# EAGLE design KGGR_D (EAGLE 9.4.2)
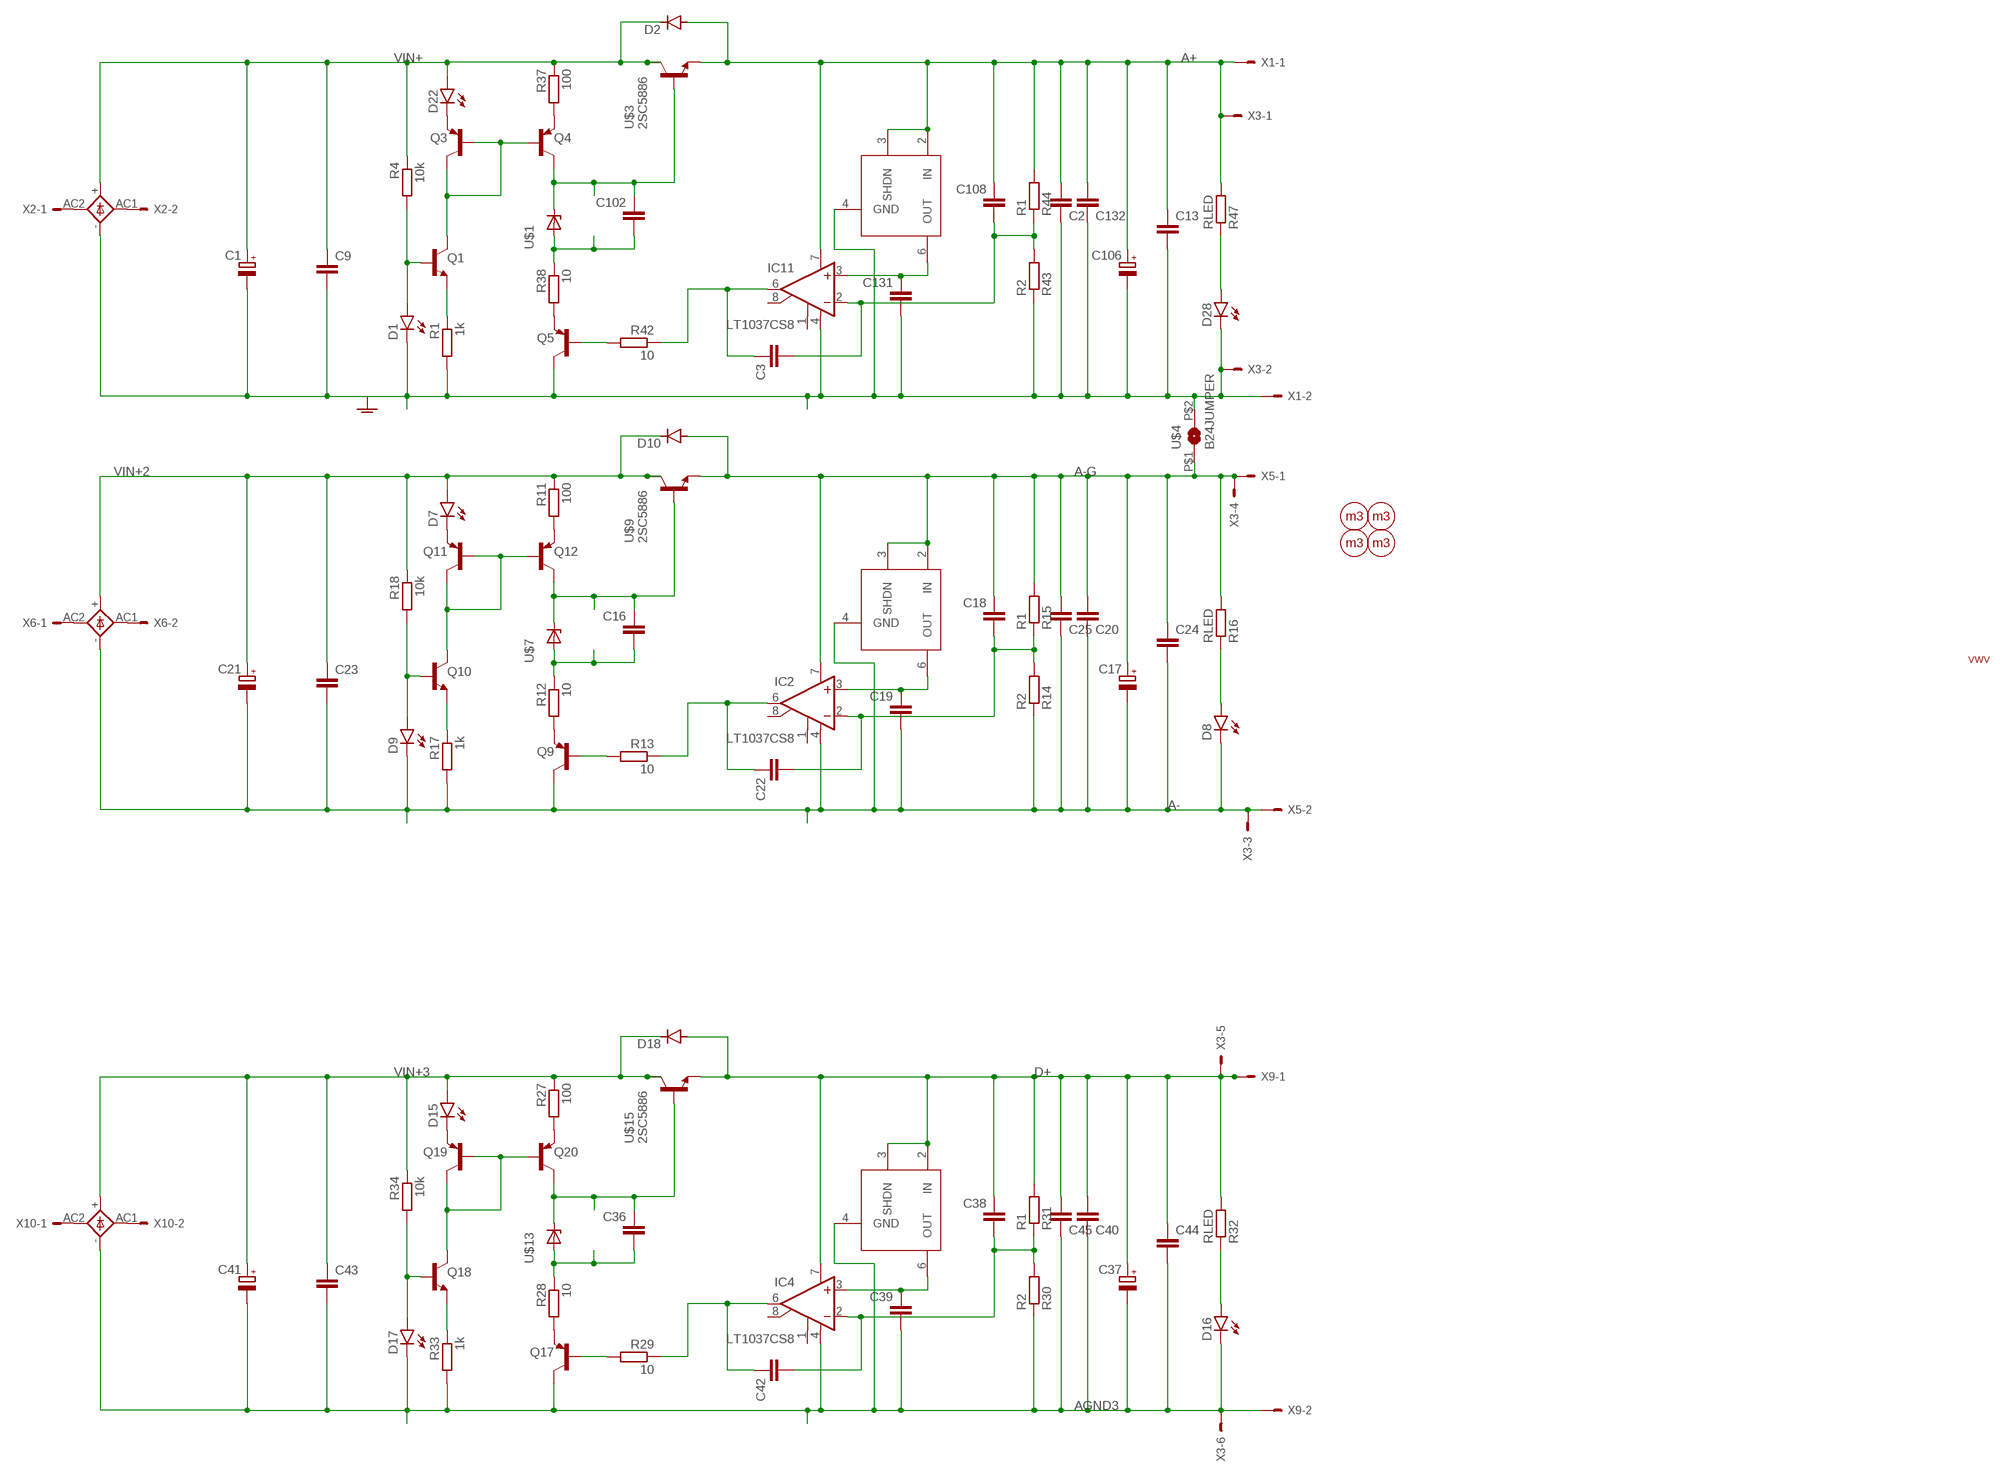
[diagram p0: schematic, sheet 1]

## Parts
B1  GBU4  [GBU4S]
B3  GBU4  [GBU4S]
B5  GBU4  [GBU4S]
C1  CPOL-EUE7.5-18  [E7,5-18]
C2  C-EUC0805  [C0805]
C3  C-EUC0805  [C0805]
C9  C-EU050-050X075  [C050-050X075]
C13  C-EU050-050X075  [C050-050X075]
C16  C-EUC0805  [C0805]
C17  CPOL-EUE5-10.5  [E5-10,5]
C18  C-EUC0805  [C0805]
C19  C-EUC1206  [C1206]
C20  C-EUC0805  [C0805]
C21  CPOL-EUE7.5-18  [E7,5-18]
C22  C-EUC0805  [C0805]
C23  C-EU050-050X075  [C050-050X075]
C24  C-EU050-050X075  [C050-050X075]
C25  C-EUC0805  [C0805]
C36  C-EUC0805  [C0805]
C37  CPOL-EUE5-10.5  [E5-10,5]
C38  C-EUC0805  [C0805]
C39  C-EUC1206  [C1206]
C40  C-EUC0805  [C0805]
C41  CPOL-EUE7.5-18  [E7,5-18]
C42  C-EUC0805  [C0805]
C43  C-EU050-050X075  [C050-050X075]
C44  C-EU050-050X075  [C050-050X075]
C45  C-EUC0805  [C0805]
C102  C-EUC0805  [C0805]
C106  CPOL-EUE5-10.5  [E5-10,5]
C108  C-EUC0805  [C0805]
C131  C-EUC1206  [C1206]
C132  C-EUC0805  [C0805]
D1  LEDVWV1206  [LED_SML1206]
D2  DIODE-DO214AC  [DO214AC]
D7  LEDVWV1206  [LED_SML1206]
D8  LEDVWV1206  [LED_SML1206]
D9  LEDVWV1206  [LED_SML1206]
D10  DIODE-DO214AC  [DO214AC]
D15  LEDVWV1206  [LED_SML1206]
D16  LEDVWV1206  [LED_SML1206]
D17  LEDVWV1206  [LED_SML1206]
D18  DIODE-DO214AC  [DO214AC]
D22  LEDVWV1206  [LED_SML1206]
D28  LEDVWV1206  [LED_SML1206]
H1  HOLE  [M3_HOLE]
H2  HOLE  [M3_HOLE]
H3  HOLE  [M3_HOLE]
H4  HOLE  [M3_HOLE]
IC2  LT1037CS8  [SOIC8]
IC4  LT1037CS8  [SOIC8]
IC11  LT1037CS8  [SOIC8]
Q1  TRANSISTOR_BC847CLT1-NPN-SOT23-BEC  [TRANSISTOR_SOT23-BEC]
Q3  TRANSISTOR_BC857C-PNP-SOT23-BEC  [TRANSISTOR_SOT23-BEC]
Q4  TRANSISTOR_BC857C-PNP-SOT23-BEC  [TRANSISTOR_SOT23-BEC]
Q5  TRANSISTOR_BC857C-PNP-SOT23-BEC  [TRANSISTOR_SOT23-BEC]
Q9  TRANSISTOR_BC857C-PNP-SOT23-BEC  [TRANSISTOR_SOT23-BEC]
Q10  TRANSISTOR_BC847CLT1-NPN-SOT23-BEC  [TRANSISTOR_SOT23-BEC]
Q11  TRANSISTOR_BC857C-PNP-SOT23-BEC  [TRANSISTOR_SOT23-BEC]
Q12  TRANSISTOR_BC857C-PNP-SOT23-BEC  [TRANSISTOR_SOT23-BEC]
Q17  TRANSISTOR_BC857C-PNP-SOT23-BEC  [TRANSISTOR_SOT23-BEC]
Q18  TRANSISTOR_BC847CLT1-NPN-SOT23-BEC  [TRANSISTOR_SOT23-BEC]
Q19  TRANSISTOR_BC857C-PNP-SOT23-BEC  [TRANSISTOR_SOT23-BEC]
Q20  TRANSISTOR_BC857C-PNP-SOT23-BEC  [TRANSISTOR_SOT23-BEC]
R1  1k  R-EU_MELF0204W  [MINI_MELF-0204W]
R4  10k  R-EU_MELF0204W  [MINI_MELF-0204W]
R11  100  R-EU_MELF0204W  [MINI_MELF-0204W]
R12  10  R-EU_MELF0204W  [MINI_MELF-0204W]
R13  10  R-EU_MELF0204W  [MINI_MELF-0204W]
R14  R2  R-EU_MELF0204W  [MINI_MELF-0204W]
R15  R1  R-EU_MELF0204W  [MINI_MELF-0204W]
R16  RLED  R-EU_MELF0204W  [MINI_MELF-0204W]
R17  1k  R-EU_MELF0204W  [MINI_MELF-0204W]
R18  10k  R-EU_MELF0204W  [MINI_MELF-0204W]
R27  100  R-EU_MELF0204W  [MINI_MELF-0204W]
R28  10  R-EU_MELF0204W  [MINI_MELF-0204W]
R29  10  R-EU_MELF0204W  [MINI_MELF-0204W]
R30  R2  R-EU_MELF0204W  [MINI_MELF-0204W]
R31  R1  R-EU_MELF0204W  [MINI_MELF-0204W]
R32  RLED  R-EU_MELF0204W  [MINI_MELF-0204W]
R33  1k  R-EU_MELF0204W  [MINI_MELF-0204W]
R34  10k  R-EU_MELF0204W  [MINI_MELF-0204W]
R37  100  R-EU_MELF0204W  [MINI_MELF-0204W]
R38  10  R-EU_MELF0204W  [MINI_MELF-0204W]
R42  10  R-EU_MELF0204W  [MINI_MELF-0204W]
R43  R2  R-EU_MELF0204W  [MINI_MELF-0204W]
R44  R1  R-EU_MELF0204W  [MINI_MELF-0204W]
R47  RLED  R-EU_MELF0204W  [MINI_MELF-0204W]
S1  VWV  [VWV]
U$1  ADR504X  [SOT-23]
U$2  LT6657  [MSOP8]
U$3  2SC5886  [NEW-PWMOLD]
U$4  B24JUMPER  [B24J]
U$7  ADR504X  [SOT-23]
U$8  LT6657  [MSOP8]
U$9  2SC5886  [NEW-PWMOLD]
U$13  ADR504X  [SOT-23]
U$14  LT6657  [MSOP8]
U$15  2SC5886  [NEW-PWMOLD]
X1  KK-156-2  [KK-156-2]
X2  KK-156-2  [KK-156-2]
X3  KK-156-6  [KK-156-6]
X5  KK-156-2  [KK-156-2]
X6  KK-156-2  [KK-156-2]
X9  KK-156-2  [KK-156-2]
X10  KK-156-2  [KK-156-2]

## Nets
A+: C2.2 C13.1 C106.+ C108.1 C132.2 D2.A IC11.7(V+) R44.2 R47.2 U$2.2(IN) U$2.3(SHDN) U$3.3(E) X1.1 X3.1
A-: B3.- C17.- C19.2 C20.1 C21.- C23.2 C24.2 C25.1 D8.C D9.C IC2.4(V-) Q9.C R14.1 R17.2 U$8.4(GND) X3.3 X5.2
A-G: C17.+ C18.1 C20.2 C24.1 C25.2 D10.A IC2.7(V+) R15.2 R16.2 U$4.P$1 U$8.2(IN) U$8.3(SHDN) U$9.3(E) X3.4 X5.1
AGND: B1.- C1.- C2.1 C9.2 C13.2 C106.- C131.2 C132.1 D1.C D28.C IC11.4(V-) Q5.C R1.2 R43.1 U$2.4(GND) U$4.P$2 X1.2 X3.2
AGND3: B5.- C37.- C39.2 C40.1 C41.- C43.2 C44.2 C45.1 D16.C D17.C IC4.4(V-) Q17.C R30.1 R33.2 U$14.4(GND) X3.6 X9.2
D+: C37.+ C38.1 C40.2 C44.1 C45.2 D18.A IC4.7(V+) R31.2 R32.2 U$14.2(IN) U$14.3(SHDN) U$15.3(E) X3.5 X9.1
N$1: C102.1 Q4.C U$1.1(OUT) U$3.1(B)
N$2: D22.C Q3.E
N$3: Q4.E R37.2
N$4: B1.AC1(AC2) X2.2
N$5: B1.AC2(AC1) X2.1
N$9: Q1.E R1.1
N$10: D1.A Q1.B R4.2
N$25: Q10.C Q11.B Q11.C Q12.B
N$26: C16.2 R12.1 U$7.2(GND)
N$27: Q9.E R12.2
N$28: Q9.B R13.2
N$29: C18.2 C22.2 IC2.2(-IN) R14.2 R15.1
N$30: D8.A R16.1
N$31: C19.1 IC2.3(+IN) U$8.6(OUT)
N$32: C22.1 IC2.6(OUT) R13.1
N$33: Q10.E R17.1
N$34: D9.A Q10.B R18.2
N$35: C16.1 Q12.C U$7.1(OUT) U$9.1(B)
N$36: D7.C Q11.E
N$37: Q12.E R11.2
N$38: B3.AC1(AC2) X6.2
N$39: B3.AC2(AC1) X6.1
N$59: Q18.C Q19.B Q19.C Q20.B
N$60: C36.2 R28.1 U$13.2(GND)
N$61: Q17.E R28.2
N$62: Q17.B R29.2
N$63: C38.2 C42.2 IC4.2(-IN) R30.2 R31.1
N$64: D16.A R32.1
N$65: C39.1 IC4.3(+IN) U$14.6(OUT)
N$66: C42.1 IC4.6(OUT) R29.1
N$68: Q18.E R33.1
N$69: D17.A Q18.B R34.2
N$71: C36.1 Q20.C U$13.1(OUT) U$15.1(B)
N$72: D15.C Q19.E
N$73: Q20.E R27.2
N$74: B5.AC1(AC2) X10.2
N$75: B5.AC2(AC1) X10.1
N$96: Q1.C Q3.B Q3.C Q4.B
N$98: C102.2 R38.1 U$1.2(GND)
N$99: Q5.E R38.2
N$105: Q5.B R42.2
N$106: C3.2 C108.2 IC11.2(-IN) R43.2 R44.1
N$108: D28.A R47.1
N$111: C131.1 IC11.3(+IN) U$2.6(OUT)
N$112: C3.1 IC11.6(OUT) R42.1
VIN+: B1.+ C1.+ C9.1 D2.C D22.A R4.1 R37.1 U$3.2(C) U$3.4(C) U$3.P$1(C) U$3.P$2(C) U$3.P$3(C) U$3.P$4(C) U$3.P$5(C) U$3.P$6(C) U$3.P$7(C) U$3.P$8(C) U$3.P$9(C) U$3.P$10(C) U$3.P$11(C) U$3.P$12(C) U$3.P$13(C) U$3.P$14(C) U$3.P$15(C) U$3.P$16(C) U$3.P$17(C) U$3.P$18(C) U$3.P$19(C) U$3.P$20(C) U$3.P$21(C) U$3.P$22(C) U$3.P$23(C) U$3.P$24(C) U$3.P$25(C) U$3.P$26(C) U$3.P$27(C) U$3.P$28(C) U$3.P$29(C) U$3.P$30(C) U$3.P$31(C) U$3.P$32(C) U$3.P$33(C) U$3.P$34(C) U$3.P$35(C) U$3.P$36(C) U$3.P$37(C) U$3.P$38(C) U$3.P$39(C) U$3.P$40(C) U$3.P$41(C) U$3.P$42(C) U$3.P$43(C) U$3.P$44(C) U$3.P$45(C) U$3.P$46(C) U$3.P$47(C) U$3.P$48(C) U$3.P$49(C) U$3.P$50(C) U$3.P$51(C) U$3.P$52(C) U$3.P$53(C) U$3.P$54(C) U$3.P$55(C) U$3.P$56(C) U$3.P$57(C) U$3.P$58(C) U$3.P$59(C) U$3.P$60(C) U$3.P$61(C) U$3.P$62(C) U$3.P$63(C)
VIN+2: B3.+ C21.+ C23.1 D7.A D10.C R11.1 R18.1 U$9.2(C) U$9.4(C) U$9.P$1(C) U$9.P$2(C) U$9.P$3(C) U$9.P$4(C) U$9.P$5(C) U$9.P$6(C) U$9.P$7(C) U$9.P$8(C) U$9.P$9(C) U$9.P$10(C) U$9.P$11(C) U$9.P$12(C) U$9.P$13(C) U$9.P$14(C) U$9.P$15(C) U$9.P$16(C) U$9.P$17(C) U$9.P$18(C) U$9.P$19(C) U$9.P$20(C) U$9.P$21(C) U$9.P$22(C) U$9.P$23(C) U$9.P$24(C) U$9.P$25(C) U$9.P$26(C) U$9.P$27(C) U$9.P$28(C) U$9.P$29(C) U$9.P$30(C) U$9.P$31(C) U$9.P$32(C) U$9.P$33(C) U$9.P$34(C) U$9.P$35(C) U$9.P$36(C) U$9.P$37(C) U$9.P$38(C) U$9.P$39(C) U$9.P$40(C) U$9.P$41(C) U$9.P$42(C) U$9.P$43(C) U$9.P$44(C) U$9.P$45(C) U$9.P$46(C) U$9.P$47(C) U$9.P$48(C) U$9.P$49(C) U$9.P$50(C) U$9.P$51(C) U$9.P$52(C) U$9.P$53(C) U$9.P$54(C) U$9.P$55(C) U$9.P$56(C) U$9.P$57(C) U$9.P$58(C) U$9.P$59(C) U$9.P$60(C) U$9.P$61(C) U$9.P$62(C) U$9.P$63(C)
VIN+3: B5.+ C41.+ C43.1 D15.A D18.C R27.1 R34.1 U$15.2(C) U$15.4(C) U$15.P$1(C) U$15.P$2(C) U$15.P$3(C) U$15.P$4(C) U$15.P$5(C) U$15.P$6(C) U$15.P$7(C) U$15.P$8(C) U$15.P$9(C) U$15.P$10(C) U$15.P$11(C) U$15.P$12(C) U$15.P$13(C) U$15.P$14(C) U$15.P$15(C) U$15.P$16(C) U$15.P$17(C) U$15.P$18(C) U$15.P$19(C) U$15.P$20(C) U$15.P$21(C) U$15.P$22(C) U$15.P$23(C) U$15.P$24(C) U$15.P$25(C) U$15.P$26(C) U$15.P$27(C) U$15.P$28(C) U$15.P$29(C) U$15.P$30(C) U$15.P$31(C) U$15.P$32(C) U$15.P$33(C) U$15.P$34(C) U$15.P$35(C) U$15.P$36(C) U$15.P$37(C) U$15.P$38(C) U$15.P$39(C) U$15.P$40(C) U$15.P$41(C) U$15.P$42(C) U$15.P$43(C) U$15.P$44(C) U$15.P$45(C) U$15.P$46(C) U$15.P$47(C) U$15.P$48(C) U$15.P$49(C) U$15.P$50(C) U$15.P$51(C) U$15.P$52(C) U$15.P$53(C) U$15.P$54(C) U$15.P$55(C) U$15.P$56(C) U$15.P$57(C) U$15.P$58(C) U$15.P$59(C) U$15.P$60(C) U$15.P$61(C) U$15.P$62(C) U$15.P$63(C)
Unconnected: IC2.1(CMP1) IC2.8(CMP2) IC4.1(CMP1) IC4.8(CMP2) IC11.1(CMP1) IC11.8(CMP2)

## Library data of the parts
B1 B3 B5 = Vwvwbg:GBU4: GENERAL INSTRUMENT RECTIFIER
C1 C17 C21 C37 C41 C106 = Vwvwbg:CPOL-EU: POLARIZED CAPACITOR, European symbol
C2 C3 C9 C13 C16 C18-C20 C22-C25 C36 C38-C40 C42-C45 C102 C108 C131 C132 = Vwvwbg:C-EU: CAPACITOR, European symbol
D1 D7-D9 D15-D17 D22 D28 = Vwvwbg:LED: LED OSRAM: - CHIPLED LG R971, LG N971, LY N971, LG Q971, LY Q971, LO R971, LY R971 LH N974, LH R974 LS Q976, LO Q976, LY Q976 LO Q996 - Hyper CHIPLED LW Q18S LB Q993, LB Q99A, LB R99A - SideLED LS A670, LO A670, LY A670, LG A670, LP A670 LB A673, LV A673, LT A673, LW A673 LH A674 LY A675 LS A676, LA A676, LO A676, LY A676, LW A676 LS A679, LY A679, LG A679 - Hyper Micro SIDELED® LS Y876, LA Y876, LO Y876, LY Y876 LT Y87S - SmartLED LW L88C, LW L88S LB L89C, LB L89S, LG L890 LS L89K, LO L89K, LY L89K LS L896, LA L896, LO L896, LY L896 - TOPLED LS T670, LO T670, LY T670, LG T670, LP T670 LSG T670, LSP T670, LSY T670, LOP T670, LYG T670 LG T671, LOG T671, LSG T671 LB T673, LV T673, LT T673, LW T673 LH T674 LS T676, LA T676, LO T676, LY T676, LB T676, LH T676, LSB T676, LW T676 LB T67C, LV T67C, LT T67C, LS T67K, LO T67K, LY T67K, LW E67C LS E67B, LA E67B, LO E67B, LY E67B, LB E67C, LV E67C, LT E67C LW T67C LS T679, LY T679, LG T679 LS T770, LO T770, LY T770, LG T770, LP T770 LB T773, LV T773, LT T773, LW T773 LH T774 LS E675, LA E675, LY E675, LS T675 LS T776, LA T776, LO T776, LY T776, LB T776 LHGB T686 LT T68C, LB T68C - Hyper Mini TOPLED® LB M676 - Mini TOPLED Santana® LG M470 LS M47K, LO M47K, LY M47K Source: http://www.osram.convergy.de LUXEON: - LUMILED® LXK2-PW12-R00, LXK2-PW12-S00, LXK2-PW14-U00, LXK2-PW14-V00 LXK2-PM12-R00, LXK2-PM12-S00, LXK2-PM14-U00 LXK2-PE12-Q00, LXK2-PE12-R00, LXK2-PE12-S00, LXK2-PE14-T00, LXK2-PE14-U00 LXK2-PB12-K00, LXK2-PB12-L00, LXK2-PB12-M00, LXK2-PB14-N00, LXK2-PB14-P00, LXK2-PB14-Q00 LXK2-PR12-L00, LXK2-PR12-M00, LXK2-PR14-Q00, LXK2-PR14-R00 LXK2-PD12-Q00, LXK2-PD12-R00, LXK2-PD12-S00 LXK2-PH12-R00, LXK2-PH12-S00 LXK2-PL12-P00, LXK2-PL12-Q00, LXK2-PL12-R00 Source: www.luxeon.com KINGBRIGHT: KA-3528ASYC Source: www.kingbright.com
D2 D10 D18 = Vwvwbg:DIODE-: DIODE
H1-H4 = Vwvwbg:HOLE
IC2 IC4 IC11 = Vwvwbg:LT10*: Low Noise, High Speed, Precision Operational Amplifiers Source: http://www.linear.com/pc/downloadDocument.do?navId=H0,C1,C1154,C1009,C1026,P1212,D2204
Q1 Q10 Q18 = Vwvwbg:TRANSISTOR_*-NPN-: NPN Transistror BF959 corrected 2008.03.06
Q3-Q5 Q9 Q11 Q12 Q17 Q19 Q20 = Vwvwbg:TRANSISTOR_*-PNP-: PNP Transistror
R1 R4 R11-R18 R27-R34 R37 R38 R42-R44 R47 = Vwvwbg:R-EU_: RESISTOR, European symbol
S1 = Vwvwbg:VWV
U$1 U$7 U$13 = Vwvwbg:ADR504X
U$2 U$8 U$14 = Vwvwbg:LT6657
U$3 U$9 U$15 = Vwvwbg:2SC5886
U$4 = Vwvwbg:B24JUMPER
X1 X2 X5 X6 X9 X10 = Vwvwbg:KK-156-2: KK 156 HEADER Source: http://www.molex.com/pdm_docs/sd/026604100_sd.pdf; MF: MOLEX; OC_FARNELL: unknown; OC_NEWARK: unknown
X3 = Vwvwbg:KK-156-6: KK 156 HEADER Source: http://www.molex.com/pdm_docs/sd/026604100_sd.pdf; MF: MOLEX; OC_FARNELL: unknown; OC_NEWARK: unknown

## Board
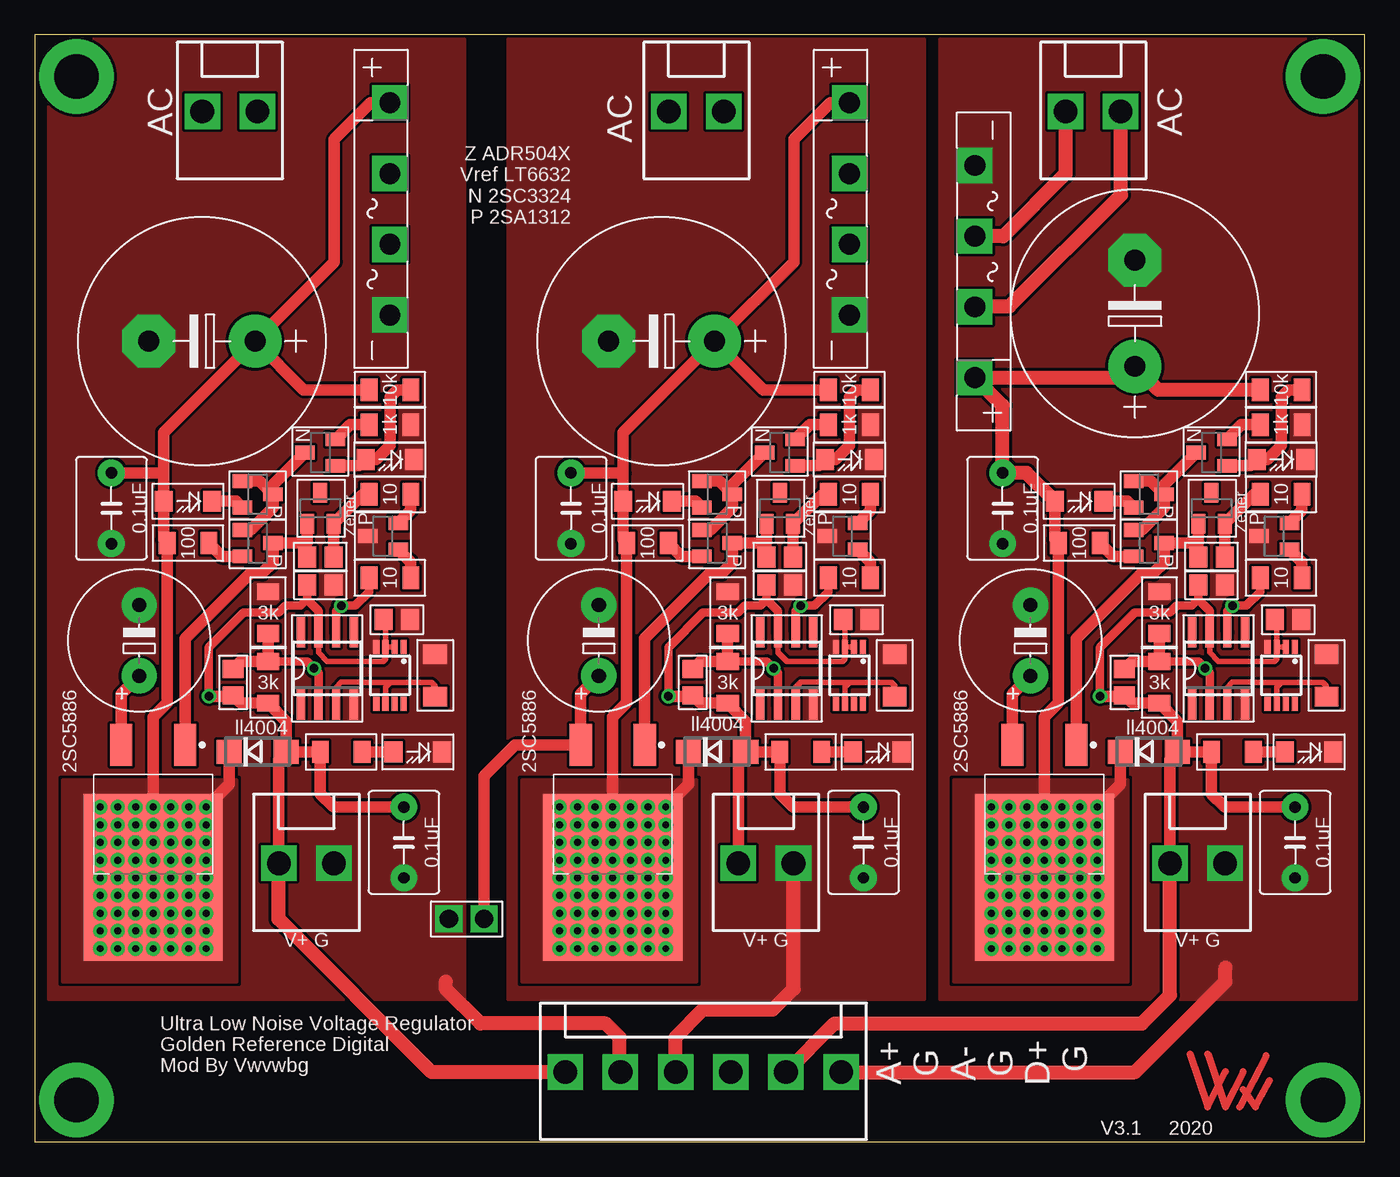
[diagram p1: board, top side]
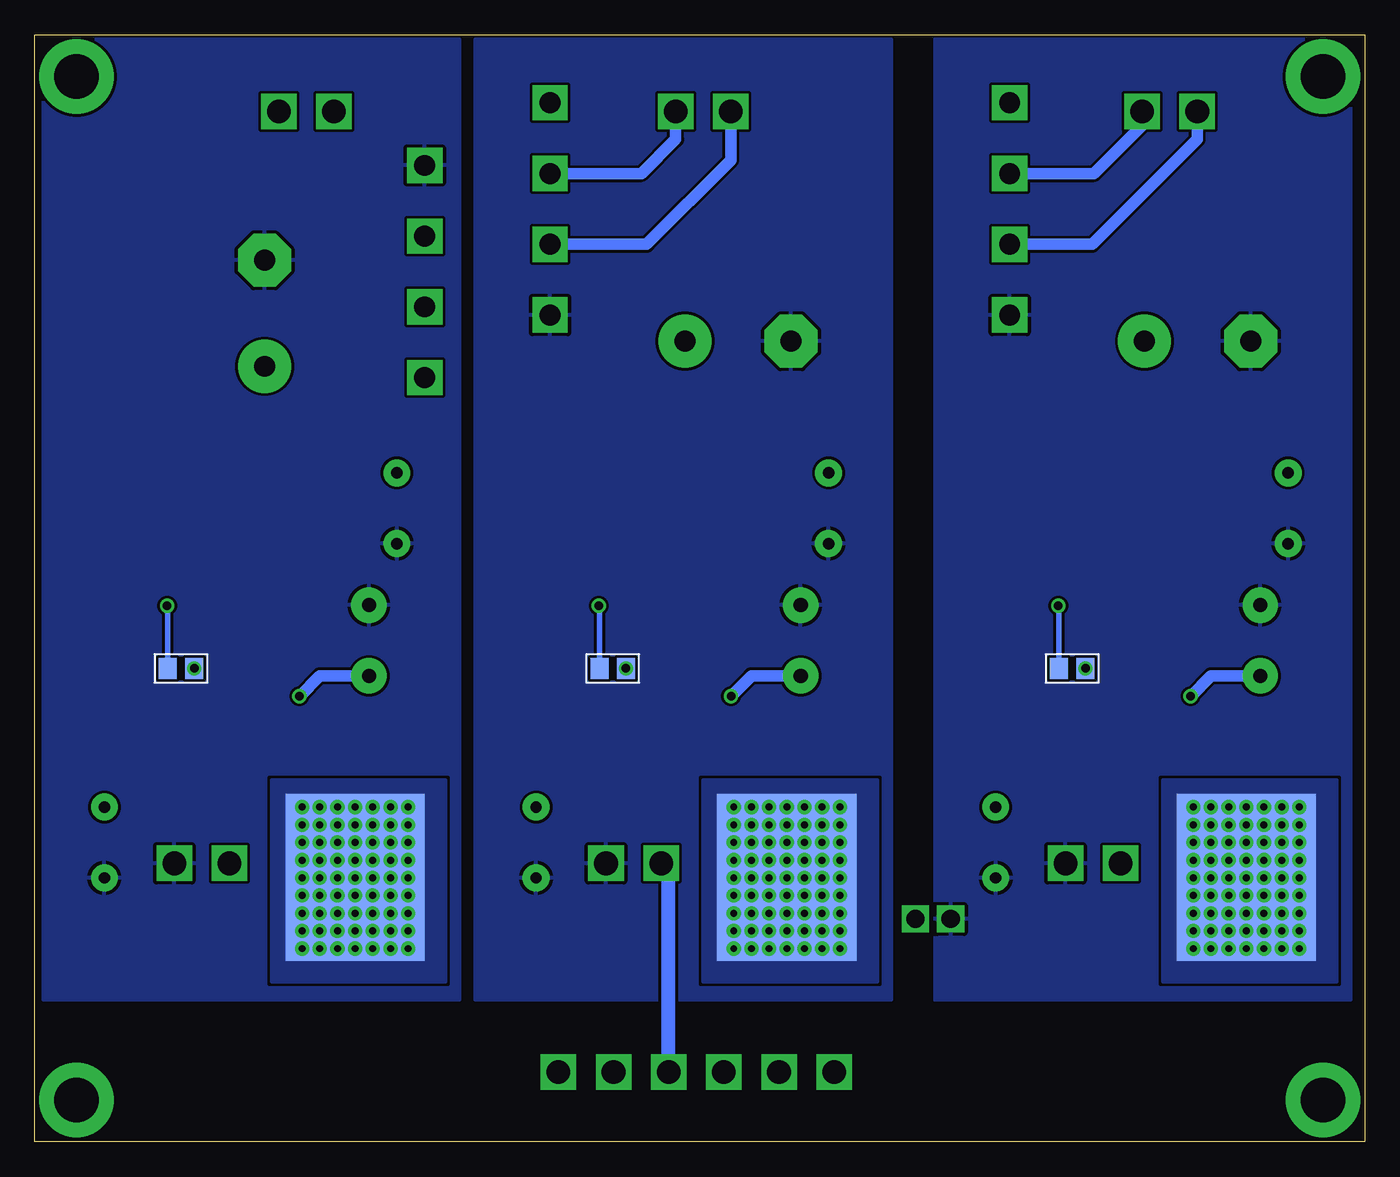
[diagram p2: board, bottom side, seen from below]

Size 95.5 x 79.5 mm. Coordinates in mm from the lower left corner, seen from the top.
Outline: 0,0 95.5,0 95.5,79.5 0,79.5 0,0
Copper layers (1*16): Top 0.035mm / dielectric 1.5mm / Bottom 0.035mm
Design rules "default *": minimum track width 10mil, minimum drill 0.35mm, track to track 8mil, track to pad 8mil, pad to pad 8mil, via to via 8mil, smd to smd 0mil, copper to edge 8mil, drill to drill 8mil, minimum pad ring 10mil, minimum via ring 8mil, stop-mask expansion 4mil, vias tented up to drill 0mil, thermal gap 10mil

### Footprints (pad centres in the part's own frame; a part is rotated, then mirrored left to right if it is on the bottom)
GBU4S = drill 1.499 pad 2.54 square: + 7.62,0; - -7.62,0; AC1 2.54,0; AC2 -2.54,0
E7,5-18 = drill 1.5 pad 3.81: + -3.81,0 | drill 1.5 pad 3.81 octagon: - 3.81,0
C0805 = smd 1.3 x 1.5: 1 -0.95,0; 2 0.95,0
C050-050X075 = drill 0.813 pad 1.93: 1 -2.54,0; 2 2.54,0
E5-10,5 = drill 1.016 pad 2.54: + -2.54,0; - 2.54,0
C1206 = smd 1.4 x 1.7: 1 -1.527,0; 2 1.527,0
LED_SML1206 = smd 1.3 x 1.5: A 1.75,0; C -1.75,0
DO214AC = smd 1.8 x 1.7: A 2.05,0; C -2.05,0
M3_HOLE = drill 3.2 pad 5.334: P$1 0,0
SOIC8 = smd 0.6 x 2.2: 1 -1.905,-2.6; 2 -0.635,-2.6; 3 0.635,-2.6; 4 1.905,-2.6; 5 1.905,2.6; 6 0.635,2.6; 7 -0.635,2.6; 8 -1.905,2.6
TRANSISTOR_SOT23-BEC = smd 1 x 1.4: B -0.95,-1.1; C 0,1.1; E 0.95,-1.1
MINI_MELF-0204W = smd 1.2 x 1.6: 1 -1.5,0; 2 1.5,0
SOT-23 = smd 1 x 1.4: 1 -0.95,-1.1; 2 0.95,-1.1; 3 0,1.1
MSOP8 = smd 0.44 x 1: 1 -0.975,-2.05; 2 -0.325,-2.05; 3 0.325,-2.05; 4 0.975,-2.05; 5 0.975,2.05; 6 0.325,2.05; 7 -0.325,2.05; 8 -0.975,2.05
NEW-PWMOLD = smd 3 x 1.6: 1 0.003,2.3; 3 0.003,-2.3 | smd 12 x 10 bottom: 2 9.5,0 | smd 12 x 10: 4 9.5,0 | drill 0.5 pad 1.016: P$1 5.734,2.54; P$2 7.004,2.54; P$3 8.274,2.54; P$4 9.544,2.54; P$5 10.814,2.54; P$6 12.084,2.54; P$7 13.354,2.54; P$8 13.354,1.27; P$9 12.084,1.27; P$10 9.544,1.27; P$11 10.814,1.27; P$12 8.274,1.27; P$13 7.004,1.27; P$14 5.734,1.27; P$15 5.734,0; P$16 7.004,0; P$17 8.274,0; P$18 9.544,0; P$19 10.814,0; P$20 12.084,0; P$21 13.354,0; P$22 13.354,-1.27; P$23 12.084,-1.27; P$24 10.814,-1.27; P$25 9.544,-1.27; P$26 8.274,-1.27; P$27 7.004,-1.27; P$28 5.734,-1.27; P$29 5.734,-2.54; P$30 7.004,-2.54; P$31 8.274,-2.54; P$32 9.544,-2.54; P$33 10.814,-2.54; P$34 12.084,-2.54; P$35 13.354,-2.54; P$36 13.354,-3.81; P$37 12.084,-3.81; P$38 10.814,-3.81; P$39 9.544,-3.81; P$40 7.004,-3.81; P$41 5.734,-3.81; P$42 8.274,-3.81; P$43 5.734,3.81; P$44 7.004,3.81; P$45 8.274,3.81; P$46 9.544,3.81; P$47 10.814,3.81; P$48 12.084,3.81; P$49 13.354,3.81; P$50 14.624,3.81; P$51 14.624,2.54; P$52 14.624,1.27; P$53 14.624,0; P$54 14.624,-1.27; P$55 14.624,-2.54; P$56 14.624,-3.81; P$57 4.464,3.81; P$58 4.464,2.54; P$59 4.464,1.27; P$60 4.464,0; P$61 4.464,-1.27; P$62 4.464,-2.54; P$63 4.464,-3.81
B24J = drill 1.3 square: P$1 -1.27,0; P$2 1.27,0
KK-156-2 = drill 1.7 pad 2.54 square: 1 -1.98,0; 2 1.98,0
KK-156-6 = drill 1.7 pad 2.54 square: 1 -9.9,0; 2 -5.94,0; 3 -1.98,0; 4 1.98,0; 5 5.94,0; 6 9.9,0

### Placement (x,y rotation side)
B1  25.5,67 90 top
B3  58.5,67 90 top
B5  67.5,62.5 270 top
C1  12,57.5 180 top
C2  26,37.5 180 top
C3  21,34 0 bottom
C9  5.5,45.5 270 top
C13  26.5,21.5 270 top
C16  53.5,42 0 top
C17  40.5,36 90 top
C18  47.25,33 90 top
C19  61.75,33.5 90 top
C20  53.5,40 180 top
C21  45,57.5 180 top
C22  54,34 0 bottom
C23  38.5,45.5 270 top
C24  59.5,21.5 270 top
C25  59,37.5 180 top
C36  84.5,42 0 top
C37  71.5,36 90 top
C38  78.25,33 90 top
C39  92.75,33.5 90 top
C40  84.5,40 180 top
C41  79,59.5 90 top
C42  85,34 0 bottom
C43  69.5,45.5 270 top
C44  90.5,21.5 270 top
C45  90,37.5 180 top
C102  20.5,42 0 top
C106  7.5,36 90 top
C108  14.25,33 90 top
C131  28.75,33.5 90 top
C132  20.5,40 180 top
D1  25.5,49 180 top
D2  16,28 0 top
D7  44,46 180 top
D8  60.5,28 180 top
D9  58.5,49 180 top
D10  49,28 0 top
D15  75,46 180 top
D16  91.5,28 180 top
D17  89.5,49 180 top
D18  80,28 0 top
D22  11,46 180 top
D28  27.5,28 180 top
H1  3,3 0 top
H2  92.5,3 0 top
H3  3,76.5 0 top
H4  92.5,76.5 0 top
IC2  54,34 0 top
IC4  85,34 0 top
IC11  21,34 0 top
Q1  20.5,49.5 90 top
Q3  16,46.5 270 top
Q4  16,43 270 top
Q5  25,43.5 90 top
Q9  58,43.5 90 top
Q10  53.5,49.5 90 top
Q11  49,46.5 270 top
Q12  49,43 270 top
Q17  89,43.5 90 top
Q18  84.5,49.5 90 top
Q19  80,46.5 270 top
Q20  80,43 270 top
R1  25.5,51.5 0 top
R4  25.5,54 0 top
R11  44,43 0 top
R12  58.5,46.5 0 top
R13  58.5,40.5 0 top
R14  49.75,38 270 top
R15  49.75,33 270 top
R16  55,28 180 top
R17  58.5,51.5 0 top
R18  58.5,54 0 top
R27  75,43 0 top
R28  89.5,46.5 0 top
R29  89.5,40.5 0 top
R30  80.75,38 270 top
R31  80.75,33 270 top
R32  86,28 180 top
R33  89.5,51.5 0 top
R34  89.5,54 0 top
R37  11,43 0 top
R38  25.5,46.5 0 top
R42  25.5,40.5 0 top
R43  16.75,38 270 top
R44  16.75,33 270 top
R47  22,28 180 top
S1  85.5,2.5 0 top
U$1  20.5,45.5 0 top
U$2  25.5,33.5 180 top
U$3  8.5,28.5 270 top
U$4  31,16 180 top
U$7  53.5,45.5 0 top
U$8  58.5,33.5 180 top
U$9  41.5,28.5 270 top
U$13  84.5,45.5 0 top
U$14  89.5,33.5 180 top
U$15  72.5,28.5 270 top
X1  19.5,20 0 top
X2  14,74 0 top
X3  48,5 0 top
X5  52.5,20 0 top
X6  47.5,74 0 top
X9  83.5,20 0 top
X10  76,74 0 top

### Tracks (layer width: path | path; a pad name or v marks a point on that pad's centre or on a via)
A+  (via drill 0.61)
  Top 0.406: U$2.3 25.18,34.67 25,34.5 21,34.5 20.36,35.13 IC11.7 | U$2.3 25.18,37.38 C2.2 | U$2.2 U$2.3
  Top 0.61: IC11.7 20.36,38.13 19.55,38.95 | C132.2 19.55,38.95 | 19.55,38.95 19.1,38.5 18,38.5 17.5,38 15,38 12.5,35.5 v12.5,32
  Top 0.813: U$3.3 6.2,32.16 C106.+ | D2.A R47.2 20.5,25 21.46,24.04 C13.1 | D2.A 18.05,30.2 R44.2 14.8,31.5 C108.1 14.2,32 v12.5,32 | D2.A 17.52,27.47 X1.1
  Top 1.016: X3.1 28.5,5 17.5,16 17.5,19.98 X1.1
  Bottom 0.813: C106.+ 11.04,33.46 v12.5,32
A-
  Top 1.016: X3.3 46.02,7.52 48,9.5 53,9.5 54.48,10.98 X5.2
  pour Top (rank 2, no thermals): 34,79.18 63.88,79.18 63.88,10.23 34,10.23
  pour Bottom (rank 2): 34,10.23 34,79.18 63.88,79.18 63.88,10.23
A-G  (via drill 0.61)
  Top 0.406: U$8.3 58.17,34.67 58,34.5 54,34.5 53.37,35.13 IC2.7 | U$8.3 58.17,37.38 C25.2 | U$8.2 U$8.3
  Top 0.61: IC2.7 53.37,38.13 52.55,38.95 | C20.2 52.55,38.95 | 52.55,38.95 52.1,38.5 51,38.5 50.5,38 48,38 45.5,35.5 v45.5,32
  Top 0.813: C17.+ 39.2,32.16 U$9.3 34.5,28.5 32.27,26.27 U$4.P$1 | D10.A R16.2 53.5,25 54.46,24.04 C24.1 | D10.A 51.05,30.2 R15.2 47.8,31.5 C18.1 47.2,32 v45.5,32 | D10.A 50.52,27.47 X5.1
  Bottom 0.813: C17.+ 44.04,33.46 v45.5,32
  Bottom 1.016: X3.4 49.98,19.46 X5.1
AGND
  Top 1.016: X3.2 42,5.06 42,7.5 41,8.5 32,8.5 29.5,11 29.5,11.5
  pour Top (rank 2, no thermals): 1,79.18 30.88,79.18 30.88,10.23 1,10.23
  pour Bottom (rank 2): 1,10.23 1,79.18 30.88,79.18 30.88,10.23
AGND3
  Top 1.016: X3.6 79,5 85.5,11.5 85.5,12.5
  pour Top (rank 2, no thermals): 65,79.18 94.88,79.18 94.88,10.23 65,10.23
  pour Bottom (rank 2): 65,10.23 65,79.18 94.88,79.18 94.88,10.23
D+  (via drill 0.61)
  Top 0.406: U$14.3 89.17,34.67 89,34.5 85,34.5 84.36,35.13 IC4.7 | U$14.3 89.17,37.38 C45.2 | U$14.2 U$14.3
  Top 0.61: IC4.7 84.36,38.13 83.55,38.95 | C40.2 83.55,38.95 | 83.55,38.95 83.1,38.5 82,38.5 81.5,38 79,38 76.5,35.5 v76.5,32
  Top 0.813: U$15.3 70.2,32.16 C37.+ | D18.A R32.2 84.5,25 85.46,24.04 C44.1 | D18.A 82.05,30.2 R31.2 78.8,31.5 C38.1 78.2,32 v76.5,32 | D18.A 81.52,27.47 X9.1
  Top 1.016: X3.5 57.44,8.5 79.5,8.5 81.52,10.52 X9.1
  Bottom 0.813: C37.+ 75.04,33.46 v76.5,32
N$1
  Top 0.813: 19.5,43 Q4.C 17.1,41.6 16.34,40.84 15.5,40.84 10.8,36.14 U$3.1 | 19.5,43 19.55,43.05 U$1.1 | C102.1 19.5,42.05 19.5,43
N$2
  Top 0.813: Q3.E 14.45,46 D22.C
N$3
  Top 0.813: R37.2 13.45,42.05 Q4.E
N$4
  Bottom 0.813: B1.AC1 19.44,69.54 15.98,73 X2.2
N$5
  Bottom 0.813: B1.AC2 19.56,64.46 12.02,72 X2.1
N$9
  Top 0.813: Q1.E 22.65,51.5 R1.1
N$10
  Top 0.813: Q1.B 23.3,48.55 D1.A 24.5,49 25.5,50 25.5,53.5 26,54 R4.2
N$25
  Top 0.813: Q10.C 50.1,47.2 Q11.C | Q11.B 49.15,47.45 Q11.C | Q12.B 48.51,43.95 50.1,45.54 Q11.C
N$26
  Top 0.813: C16.2 U$7.2 56.55,46.5 R12.1
N$27
  Top 0.813: R12.2 60,45.35 Q9.E
N$28
  Top 0.813: Q9.B 60,41.65 R13.2
N$29  (via drill 0.61)
  Top 0.61: IC2.2 53.37,33.69 C22.2 52.55,34.5 R15.1
  Top 0.813: C18.2 47.8,34.5 R15.1 R14.2
  other vias: 53.05,34
N$30
  Top 0.813: R16.1 D8.A
N$31
  Top 0.406: IC2.3 54.63,32.63 55.01,33.01 56.41,33.01 56.42,33 58.5,33 | 58.5,33 61.5,33 61.75,32.75 C19.1 | 58.5,33 58.17,32.67 U$8.6
N$32  (via drill 0.61)
  Top 0.61: IC2.6 54.63,38.13 v55,38.5 56,38.5 57,39.5 R13.1
  Bottom 0.406: C22.1 54.95,38.45 v55,38.5
N$33
  Top 0.813: Q10.E 55.65,51.5 R17.1
N$34
  Top 0.813: Q10.B 56.3,48.55 D9.A 57.5,49 58.5,50 58.5,53.5 59,54 R18.2
N$35
  Top 0.813: 52.5,43 Q12.C 50.1,41.6 49.34,40.84 48.5,40.84 43.8,36.14 U$9.1 | 52.5,43 52.55,43.05 U$7.1 | C16.1 52.5,42.05 52.5,43
N$36
  Top 0.813: Q11.E 47.45,46 D7.C
N$37
  Top 0.813: R11.2 46.45,42.05 Q12.E
N$38
  Bottom 0.813: B3.AC1 51.94,69.54 49.48,72 X6.2
N$39
  Bottom 0.813: B3.AC2 51.56,64.46 45.52,70.5 X6.1
N$59
  Top 0.813: Q18.C 81.1,47.2 Q19.C | Q19.B 80.15,47.45 Q19.C | Q20.B 79.51,43.95 81.1,45.54 Q19.C
N$60
  Top 0.813: C36.2 U$13.2 87.55,46.5 R28.1
N$61
  Top 0.813: R28.2 91,45.35 Q17.E
N$62
  Top 0.813: Q17.B 91,41.65 R29.2
N$63  (via drill 0.61)
  Top 0.61: IC4.2 84.36,33.69 C42.2 83.55,34.5 R31.1
  Top 0.813: C38.2 78.8,34.5 R31.1 R30.2
  other vias: 84.05,34
N$64
  Top 0.813: R32.1 D16.A
N$65
  Top 0.406: IC4.3 85.64,32.63 86.01,33.01 87.42,33.01 87.42,33 89.5,33 | 89.5,33 92.5,33 92.75,32.75 C39.1 | 89.5,33 89.17,32.67 U$14.6
N$66  (via drill 0.61)
  Top 0.61: IC4.6 85.64,38.13 v86,38.5 87,38.5 88,39.5 R29.1
  Bottom 0.406: C42.1 85.95,38.45 v86,38.5
N$68
  Top 0.813: Q18.E 86.65,51.5 R33.1
N$69
  Top 0.813: Q18.B 87.3,48.55 D17.A 88.5,49 89.5,50 89.5,53.5 90,54 R34.2
N$71
  Top 0.813: 83.5,43 Q20.C 81.1,41.6 80.34,40.84 79.5,40.84 74.8,36.14 U$15.1 | 83.5,43 83.55,43.05 U$13.1 | C36.1 83.5,42.05 83.5,43
N$72
  Top 0.813: Q19.E 78.45,46 D15.C
N$73
  Top 0.813: R27.2 77.45,42.05 Q20.E
N$74
  Top 1.016: B5.AC1 67.54,60 70,60 78,68 78,73.98 X10.2
N$75
  Top 1.016: X10.1 74.02,69.52 69.54,65.04 B5.AC2
N$96
  Top 0.813: Q1.C 17.1,47.2 Q3.C | Q3.B 16.15,47.45 Q3.C | Q4.B 15.51,43.95 17.1,45.54 Q3.C
N$98
  Top 0.813: C102.2 U$1.2 23.55,46.5 R38.1
N$99
  Top 0.813: R38.2 27,45.35 Q5.E
N$105
  Top 0.813: Q5.B 27,41.65 R42.2
N$106  (via drill 0.61)
  Top 0.61: IC11.2 20.36,33.69 C3.2 19.55,34.5 R44.1
  Top 0.813: C108.2 14.8,34.5 R44.1 R43.2
  other vias: 20.05,34
N$108
  Top 0.813: R47.1 D28.A
N$111
  Top 0.406: IC11.3 21.64,32.63 22.01,33.01 23.41,33.01 23.42,33 25.5,33 | 25.5,33 28.5,33 28.75,32.75 C131.1 | 25.5,33 25.18,32.67 U$2.6
N$112  (via drill 0.61)
  Top 0.61: IC11.6 21.64,38.13 v22,38.5 23,38.5 24,39.5 R42.1
  Bottom 0.406: C3.1 21.95,38.45 v22,38.5
VIN+
  Top 0.813: D2.C 13.95,25.68 U$3.P$57 | U$3.P$60 8.5,30.5 9.5,31.5 R37.1 9.25,43.25 D22.A 9.25,48 | 9.25,48 9.25,50.94 C1.+ | C9.1 9.21,48.04 9.25,48 | C1.+ 21.5,63.19 21.5,72 24.12,74.62 B1.+ | R4.1 19.31,54 C1.+
  pour Top (no thermals): 2,26 14.5,26 14.5,11.5 2,11.5
  pour Bottom (no thermals): 2,26 14.5,26 14.5,11.5 2,11.5
VIN+2
  Top 0.813: D10.C 46.95,25.68 U$9.P$57 | U$9.P$60 41.5,30.5 42.5,31.5 R11.1 42.25,43.25 D7.A 42.25,48 | 42.25,48 42.25,50.94 C21.+ | C23.1 42.21,48.04 42.25,48 | C21.+ 54.5,63.19 54.5,72 57.12,74.62 B3.+ | R18.1 52.31,54 C21.+
  pour Bottom (no thermals): 35,26 47.5,26 47.5,11.5 35,11.5
  pour Top (no thermals): 35,26 47.5,26 47.5,11.5 35,11.5
VIN+3
  Top 0.813: D15.A 73.25,43.25 R27.1 73.5,31.5 72.5,30.5 U$15.P$60 | D18.C 77.95,25.68 U$15.P$57
  Top 1.016: R34.1 80.69,54 C41.+ 78.19,54.88 B5.+ 69.5,52.88 C43.1 71.21,48.04 D15.A
  pour Bottom (no thermals): 66,26 78.5,26 78.5,11.5 66,11.5
  pour Top (no thermals): 66,26 78.5,26 78.5,11.5 66,11.5

### Text on the board
tPlace: AC | AC | AC | Z ADR504X / Vref LT6632 / N 2SC3324 / P 2SA1312 | 10k | 10k | 10k | 1k | 1k | 1k | N | N | N | 0.1uF | 10 | 0.1uF | 10 | 0.1uF | 10 | P | P | P | P | P | P | Zener | Zener | Zener | 100 | 100 | 100 | P | P | P | 10 | 10 | 10 | 3k | 3k | 3k | 3k | 3k | 3k | ll4004 | ll4004 | ll4004 | 2SC5886 | 2SC5886 | 2SC5886 | 0.1uF | 0.1uF | 0.1uF | V+ G | V+ G | V+ G | Ultra Low Noise Voltage Regulator | Golden Reference Digital | A+ / G / A- / G / D+ / G | Mod By Vwvwbg | V3.1 | 2020